# Altium schematic sheet DAC.SchDoc
size B; SheetNumber: 8; SheetTotal: 10
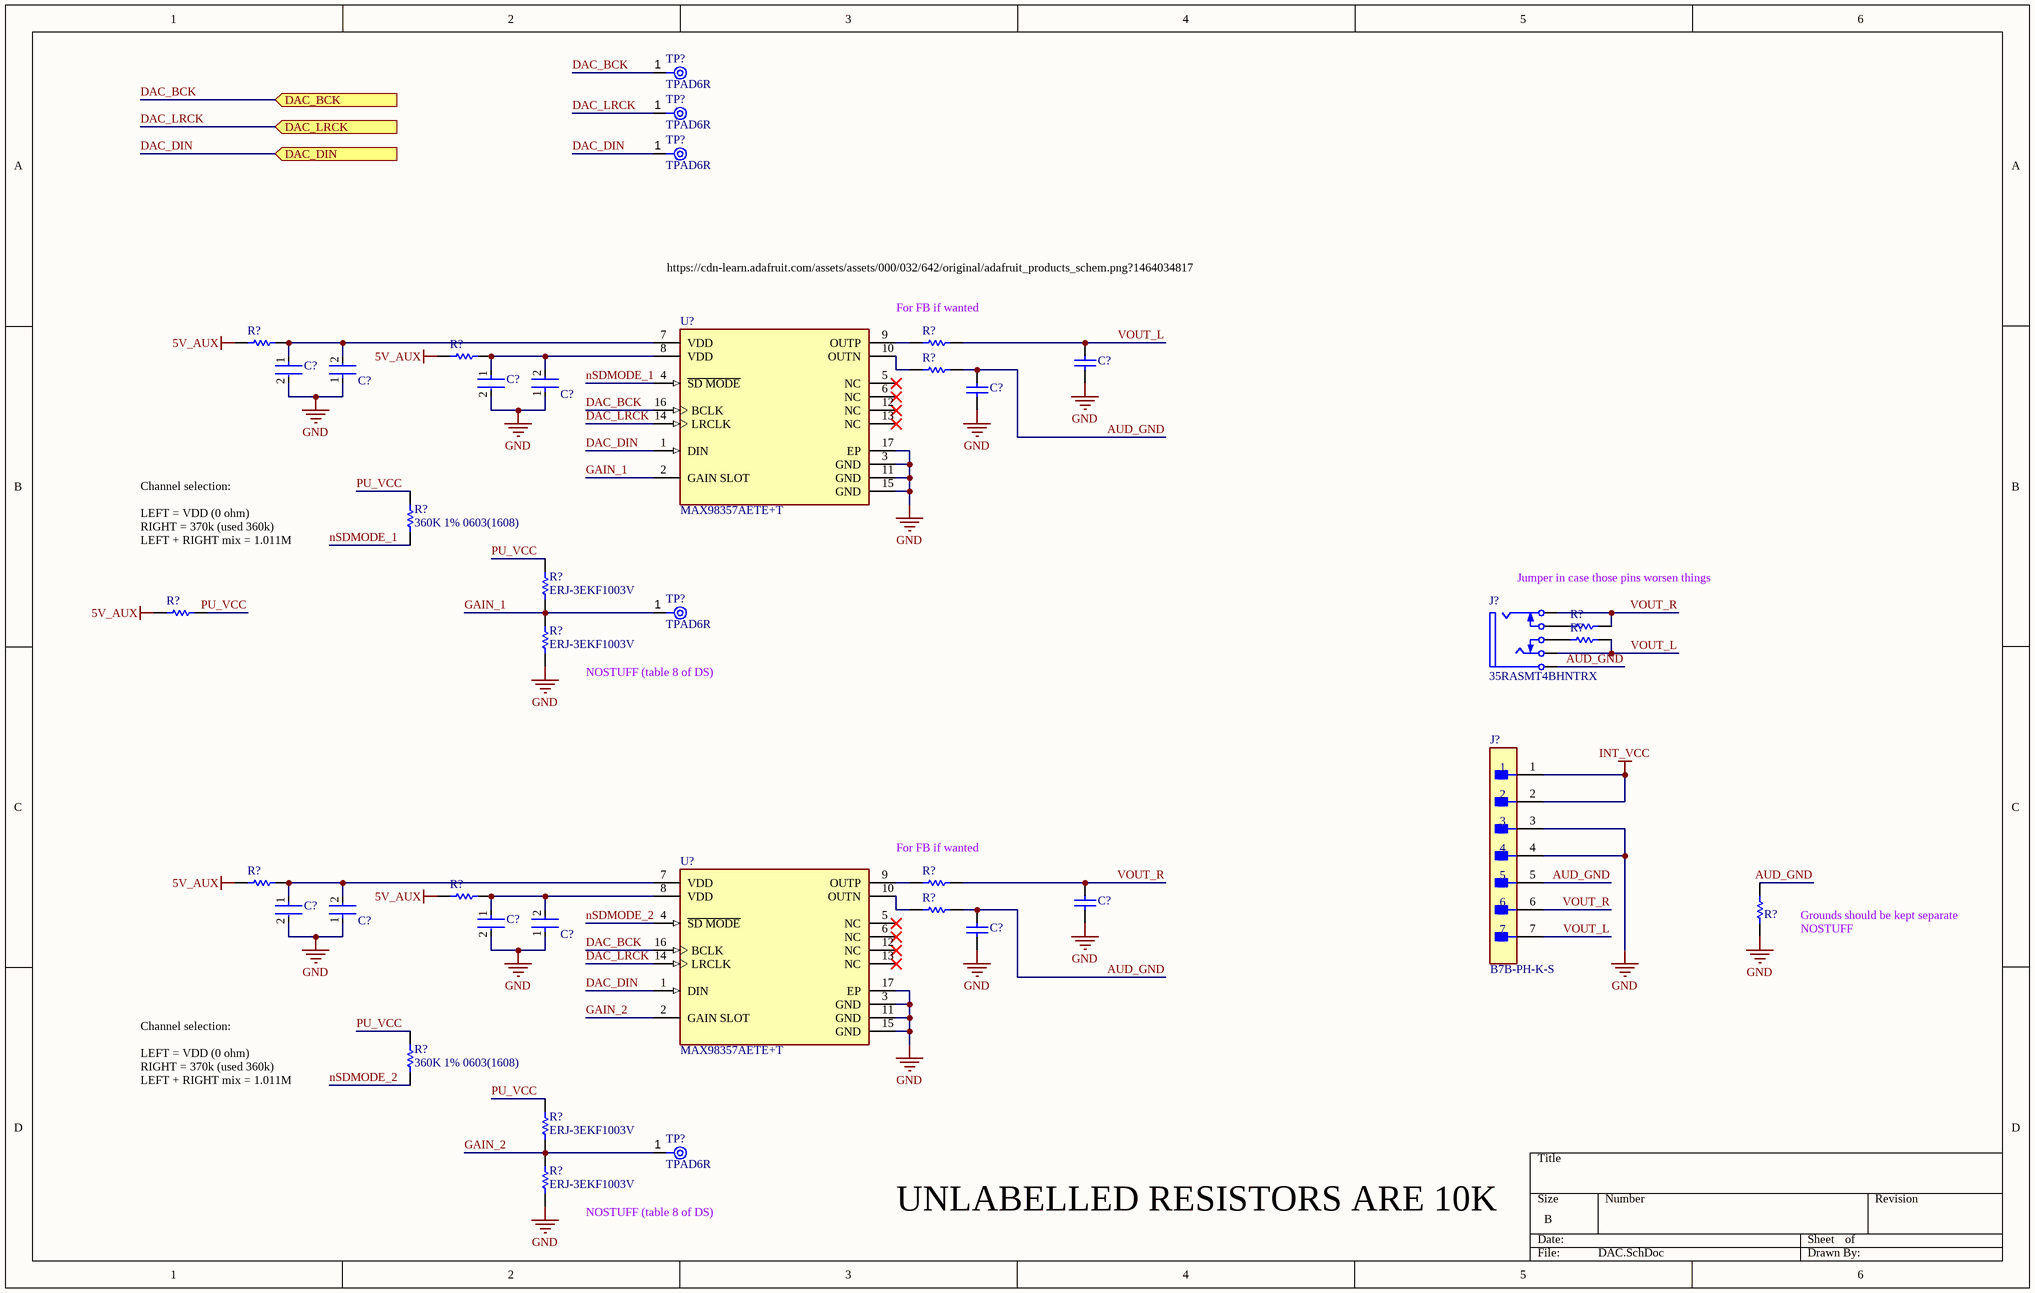
[diagram p0: DAC.SchDoc]

## Parts
(Parts that share a designator on the sheet are numbered #1, #2 ... from top to bottom, then left to right.)
C?#1  CL05A106MP5NUNC  [FP-CL05A106MP5NUNC-MFG]  (value not drawn)
C?#2  CL05A106MP5NUNC  [FP-CL05A106MP5NUNC-MFG]  (value not drawn)
C?#3  C0805C221K5RACTU  [CAPC2013X88X50ML20T25]  (value not drawn)
C?#4  C1005X7R1H104K050BB  [FP-C1005-050-0_05-IPC_C]  (value not drawn)
C?#5  C1005X7R1H104K050BB  [FP-C1005-050-0_05-IPC_C]  (value not drawn)
C?#6  C0805C221K5RACTU  [CAPC2013X88X50ML20T25]  (value not drawn)
C?#7  CL05A106MP5NUNC  [FP-CL05A106MP5NUNC-MFG]  (value not drawn)
C?#8  CL05A106MP5NUNC  [FP-CL05A106MP5NUNC-MFG]  (value not drawn)
C?#9  C0805C221K5RACTU  [CAPC2013X88X50ML20T25]  (value not drawn)
C?#10  C1005X7R1H104K050BB  [FP-C1005-050-0_05-IPC_C]  (value not drawn)
C?#11  C1005X7R1H104K050BB  [FP-C1005-050-0_05-IPC_C]  (value not drawn)
C?#12  C0805C221K5RACTU  [CAPC2013X88X50ML20T25]  (value not drawn)
J?#1  35RASMT4BHNTRX  [SWIT-35RASMT4BHNTRX_V]
J?#2  B7B-PH-K-S  [FP-B7B-PH-K-S-MFG]
R?#1  RC0402JR-070RL  [RESC1005X40X25NL05T10]  (value not drawn)
R?#2  RC0402JR-070RL  [RESC1005X40X25NL05T10]  (value not drawn)
R?#3  RC0603JR-070RL  [RESC1608X55X25ML10T15]  (value not drawn)
R?#4  RC0603JR-070RL  [RESC1608X55X25ML10T15]  (value not drawn)
R?#5  360K 1% 0603(1608)  [RESC0603(1608)_M]
R?#6  RC0402JR-070RL  [RESC1005X40X25NL05T10]  (value not drawn)
R?#7  ERJ-3EKF1003V  [RESC1608X55X30ML15T15]
R?#8  RC0402JR-070RL  [RESC1005X40X25NL05T10]  (value not drawn)
R?#9  RC0402JR-070RL  [RESC1005X40X25NL05T10]  (value not drawn)
R?#10  ERJ-3EKF1003V  [RESC1608X55X30ML15T15]
R?#11  RC0402JR-070RL  [RESC1005X40X25NL05T10]  (value not drawn)
R?#12  RC0402JR-070RL  [RESC1005X40X25NL05T10]  (value not drawn)
R?#13  RC0603JR-070RL  [RESC1608X55X25ML10T15]  (value not drawn)
R?#14  RC0603JR-070RL  [RESC1608X55X25ML10T15]  (value not drawn)
R?#15  RC0603JR-070RL  [RESC1608X55X25ML10T15]  (value not drawn)
R?#16  360K 1% 0603(1608)  [RESC0603(1608)_M]
R?#17  ERJ-3EKF1003V  [RESC1608X55X30ML15T15]
R?#18  ERJ-3EKF1003V  [RESC1608X55X30ML15T15]
TP?#1  TPAD6R  [New footprint 1]
TP?#2  TPAD6R  [New footprint 1]
TP?#3  TPAD6R  [New footprint 1]
TP?#4  TPAD6R  [New footprint 1]
TP?#5  TPAD6R  [New footprint 1]
U?#1  MAX98357AETE+T  [FP-T1633-4-MFG]
U?#2  MAX98357AETE+T  [FP-T1633-4-MFG]

## Ports
DAC_BCK (in, see MAIN_BOARD[5D]), DAC_DIN (in, see MAIN_BOARD[5D]), DAC_LRCK (in, see MAIN_BOARD[5D])

## Nets
5V_AUX: R?#1.1 R?#2.1 R?#6.1 R?#11.1 R?#12.1
GND: C?#1.2 C?#2.2 C?#3.1 C?#4.1 C?#5.1 C?#6.1 C?#7.2 C?#8.2 C?#9.1 C?#10.1 C?#11.1 C?#12.1 J?#2.3 J?#2.4 R?#10.1 R?#14.2 R?#18.1 U?#1.3(GND) U?#1.11(GND) U?#1.15(GND) U?#1.17(EP) U?#2.3(GND) U?#2.11(GND) U?#2.15(GND) U?#2.17(EP)
INT_VCC: J?#2.1 J?#2.2
AUD_GND: C?#6.2 C?#12.2 J?#1.1 J?#2.5 R?#4.2 R?#14.1 R?#15.2
DAC_BCK: TP?#1.1(TP) U?#1.16(BCLK) U?#2.16(BCLK) ; port DAC_BCK
DAC_DIN: TP?#3.1(TP) U?#1.1(DIN) U?#2.1(DIN) ; port DAC_DIN
DAC_LRCK: TP?#2.1(TP) U?#1.14(LRCLK) U?#2.14(LRCLK) ; port DAC_LRCK
GAIN_1: R?#7.1 R?#10.2 TP?#4.1(TP) U?#1.2(GAIN_SLOT)
GAIN_2: R?#17.1 R?#18.2 TP?#5.1(TP) U?#2.2(GAIN_SLOT)
nSDMODE_1: R?#5.1 U?#1.4(~{SD_MODE})
nSDMODE_2: R?#16.1 U?#2.4(~{SD_MODE})
PU_VCC: R?#5.2 R?#6.2 R?#7.2 R?#16.2 R?#17.2
VOUT_L: C?#3.2 J?#1.3 J?#2.7 R?#3.2 R?#9.2
VOUT_R: C?#9.2 J?#1.2 J?#2.6 R?#8.2 R?#13.2
NetC?#1_1: C?#1.1 C?#4.2 R?#1.2 U?#1.7(VDD)
NetC?#2_1: C?#2.1 C?#5.2 R?#2.2 U?#1.8(VDD)
NetC?#7_1: C?#7.1 C?#10.2 R?#11.2 U?#2.7(VDD)
NetC?#8_1: C?#8.1 C?#11.2 R?#12.2 U?#2.8(VDD)
NetJ?#1_4: J?#1.4 R?#8.1
NetJ?#1_5: J?#1.5 R?#9.1
NetR?#3_1: R?#3.1 U?#1.9(OUTP)
NetR?#4_1: R?#4.1 U?#1.10(OUTN)
NetR?#13_1: R?#13.1 U?#2.9(OUTP)
NetR?#15_1: R?#15.1 U?#2.10(OUTN)

Not connected (* = marked no-connect by the designer): U?#1 5(NC)* 6(NC)* 12(NC)* 13(NC)*; U?#2 5(NC)* 6(NC)* 12(NC)* 13(NC)*

## Notes on the sheet
- https://cdn-learn.adafruit.com/assets/assets/000/032/642/original/adafruit_products_schem.png?1464034817
- For FB if wanted
- Channel selection:
  LEFT = VDD (0 ohm)
  RIGHT = 370k (used 360k)
  LEFT + RIGHT mix = 1.011M
- Jumper in case those pins worsen things
- NOSTUFF (table 8 of DS)
- (near R?#14) Grounds should be kept separate
- (near R?#14) NOSTUFF
- UNLABELLED RESISTORS ARE 10K

## Library data of the parts
C?#1 C?#2 C?#7 C?#8 = CMP-13271-000002-1: CAP CER 10UF 10V X5R 0402; Manufacturer: Samsung; Temperature Coefficient: 15%; Tolerance: 20%; Material: Ceramic; Octopart: https://octopart.com/cl05a106mp5nunc-samsung-22457395; Voltage Rating: 10V; RoHS: TRUE; Value: 10uF; Height: 0.7mm; Digikey Description: CAP CER 10UF 10V X5R 0402; Automotive: No; Package: CL05A106MP5NUNC; Device Class L1: Passive Components; Capacitance: 10uF; Temperature Range High: +85°C; ComponentLink2Description: Datasheet; Device Class L2: Capacitors; Temperature Characteristic: X5R; Manufacturer Part Number: CL05A106MP5NUNC; Temperature: -55°C to +85°C; ComponentLink2URL: http://www.samsungsem.com/kr/support/product-search/mlcc/__icsFiles/afieldfile/2019/05/10/19-CL05A106MP5NUNC.pdf; Device Class L3: Ceramic Capacitors; Category: Cap; Temperature Range Low: -55°C; Ipc Land Pattern Name: CAPC10050X50; Lead Free: Yes
C?#3 C?#6 C?#9 C?#12 = CMP-2007-00321-1: Manufacturer: Kemet; Part Number: C0805C221K5RACTU
C?#4 C?#5 C?#10 C?#11 = CMP-2000-05393-2: Multilayer Ceramic Capacitors 100nF ±10% 50V X7R SMD 0402; Voltage: 50V; Dielectric Material: Ceramic; Min Operating Temperature: -55°C; Depth: 0.5mm; Radiation Hardening: No; RoHS Compliant: Yes; Voltage Rating (DC): 50V; Lead Free: Lead Free; Resistor Type: Ceramic; Height: 0.5mm; Dielectric: X7R; Thickness: 0.022inch; Case/Package: 0402; Case Code (Metric): 1005; Termination: SMD/SMT; Capacitance: 100nF; Packaging: Tape and Reel; Max Operating Temperature: 125°C; Mount: Surface Mount; Package Quantity: 1; Width: 0.02inch; Weight: 2.3E-05oz; Voltage Rating: 50V; Tolerance: 10%; Construction: Flat; Case Code (Imperial): 0402; Length: 1mm; REACH SVHC: No SVHC; Series: C
J?#1 = CMP-1772-00001-1: Female 3.5 mm Phone Jack, 5 Position, Height 5 mm, RoHS, Tape and Reel; Current Rating: 50 mA; Voltage Rating (DC): 12 V; ComponentLink1URL: http://www.switchcraft.com/; ComponentLink2Description: Datasheet; ComponentLink2URL: http://www.switchcraft.com/Drawings/35rasmt4bhntrx_cd.pdf; PackageDescription: Female 3.5 mm Phone Jack, 5 Position, Height 5 mm; PackageReference: 35RASMT4BHNTRX; Mount: Through Hole; DatasheetVersion: Rev. C, 07/2014; Contact Material: Silver; ComponentLink1Description: Manufacturer URL; Packaging: Tape and Reel; RoHSCompliant: true; Contact Plating: Silver; Package Quantity: 3000
J?#2 = CMP-17439-000359-1: CONN HEADER VERT 7POS 2MM; Contact Resistance: 10mR; Current Rating: 2A; Pitch: 0.079inch; Test Voltage: 800V; Gender: Male; Insulation Resistance: 1GR; Connector Type: Male Pin; Number of Contacts: 7; Contact Mating Length: 0.13inch; Color: Natural; Contact Material: Bronze; Contact Plating: Tin; Series: PH; Housing Color: Natural; Fastening Type: Detent; Orientation: Vertical; Mount: Through Hole; Housing Material: Nylon; Contact Type: Male Pin; Packaging: Bulk; Lead Free: Contains Lead; Number of Rows: 1; Package Quantity: 500; Termination: Press-Fit; Number of Positions: 7
R?#1 R?#2 R?#6 R?#8 R?#9 R?#11 R?#12 = CMP-1011-00001-2: Manufacturer: Yageo / Phycomp; Part Number: RC0402JR-070RL
R?#3 R?#4 R?#13-R?#15 = CMP-2100-03667-1: Chip Resistor, 0 Ohm, +/- 5%, 0.1 W, -55 to 155 degC, 0603 (1608 Metric), RoHS, Tape and Reel; Manufacturer: Yageo; Temperature Coefficient: 200ppm/degreesC; Voltage Rating: 50V; Power Rating: 100mW; Resistance: 0mOhm; Width: 0.8mm; Max Operating Temperature: 155degC; Tolerance: 5%; Package Reference: 0603; Height: 0.45mm; Depth: 0.8mm; Package Description: 2-Pin Surface Mount Device, Body 1.6 x 0.8 mm; Termination: SMD/SMT; Package Quantity: 5000; Case/Package: 0603; Case Code (Imperial): 0603; Radiation Hardening: No; Number of Pins: 2; Length: 1.6mm; Lead Free: LeadFree; Voltage Rating (DC): 50V; Military Standard: Not; Datasheet URL: http://www.yageo.com/NewPortal/yageodocoutput?fileName=/pdf/R-Chip/PYu-RC_Group_51_RoHS_L_5.pdf; Manufacturer URL: http://www.yageo.com/; Packaging: TapeandReel; Case Code (Metric): 1608; Min Operating Temperature: -55degC; Composition: ThickFilm; RoHSCompliant: true; Contact Plating: Tin; Datasheet Version: Rev. 5, 10/2016; REACH SVHC: NoSVHC
R?#5 R?#16 = CMP-1012-00798-1: 360K 0.1W 1% 0603 (1608 Metric)  SMD; Case-Metric: 1608; Case-EIA: 0603; Value: 360000.00 Ohm; Power: 0.1 W; Tolerance: 1 %; Technology: SMT
R?#7 R?#10 R?#17 R?#18 = CMP-2000-00182-1: Manufacturer: Panasonic; Part Number: ERJ-3EKF1003V
TP?#1-TP?#5 = CMP-00025-2: Test Point .6mm
U?#1 U?#2 = CMP-05698-000018-1: IC AMP CLASS D MONO 3.2W 16TQFN; Max Supply Voltage: 5.5V; Max Output Current: 1.6A; Voltage Gain: 15dB; Max Power Dissipation: 1.666W; Min Supply Voltage: 2.5V; Power Supply Rejection Ratio (PSRR): 77dB; Series: -; Contact Plating: Tin; Min Operating Temperature: -40°C; Packaging: Tape and Reel; Max Output Power: 3.2W; Mount: Surface Mount; Number of Pins: 16; RoHS Compliant: Yes; Max Operating Temperature: 85°C; Radiation Hardening: No